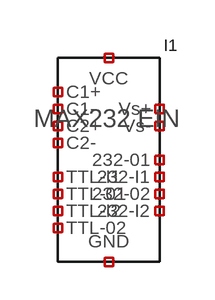
[diagram p0: schematic Draft5.asc]
Draft5.asc, the LTspice schematic file:
Version 4
SHEET 1 880 680
SYMBOL MAX232EIN -32 112 R0
SYMATTR InstName I1

The netlist it stands for:
* Draft5.asc
I1 NC_01 NC_02 NC_03 NC_04 NC_05 NC_06 NC_07 NC_08 NC_09 NC_10 NC_11 NC_12 NC_13 NC_14 NC_15 NC_16 RS-232 MAX232EIN
.backanno
.end